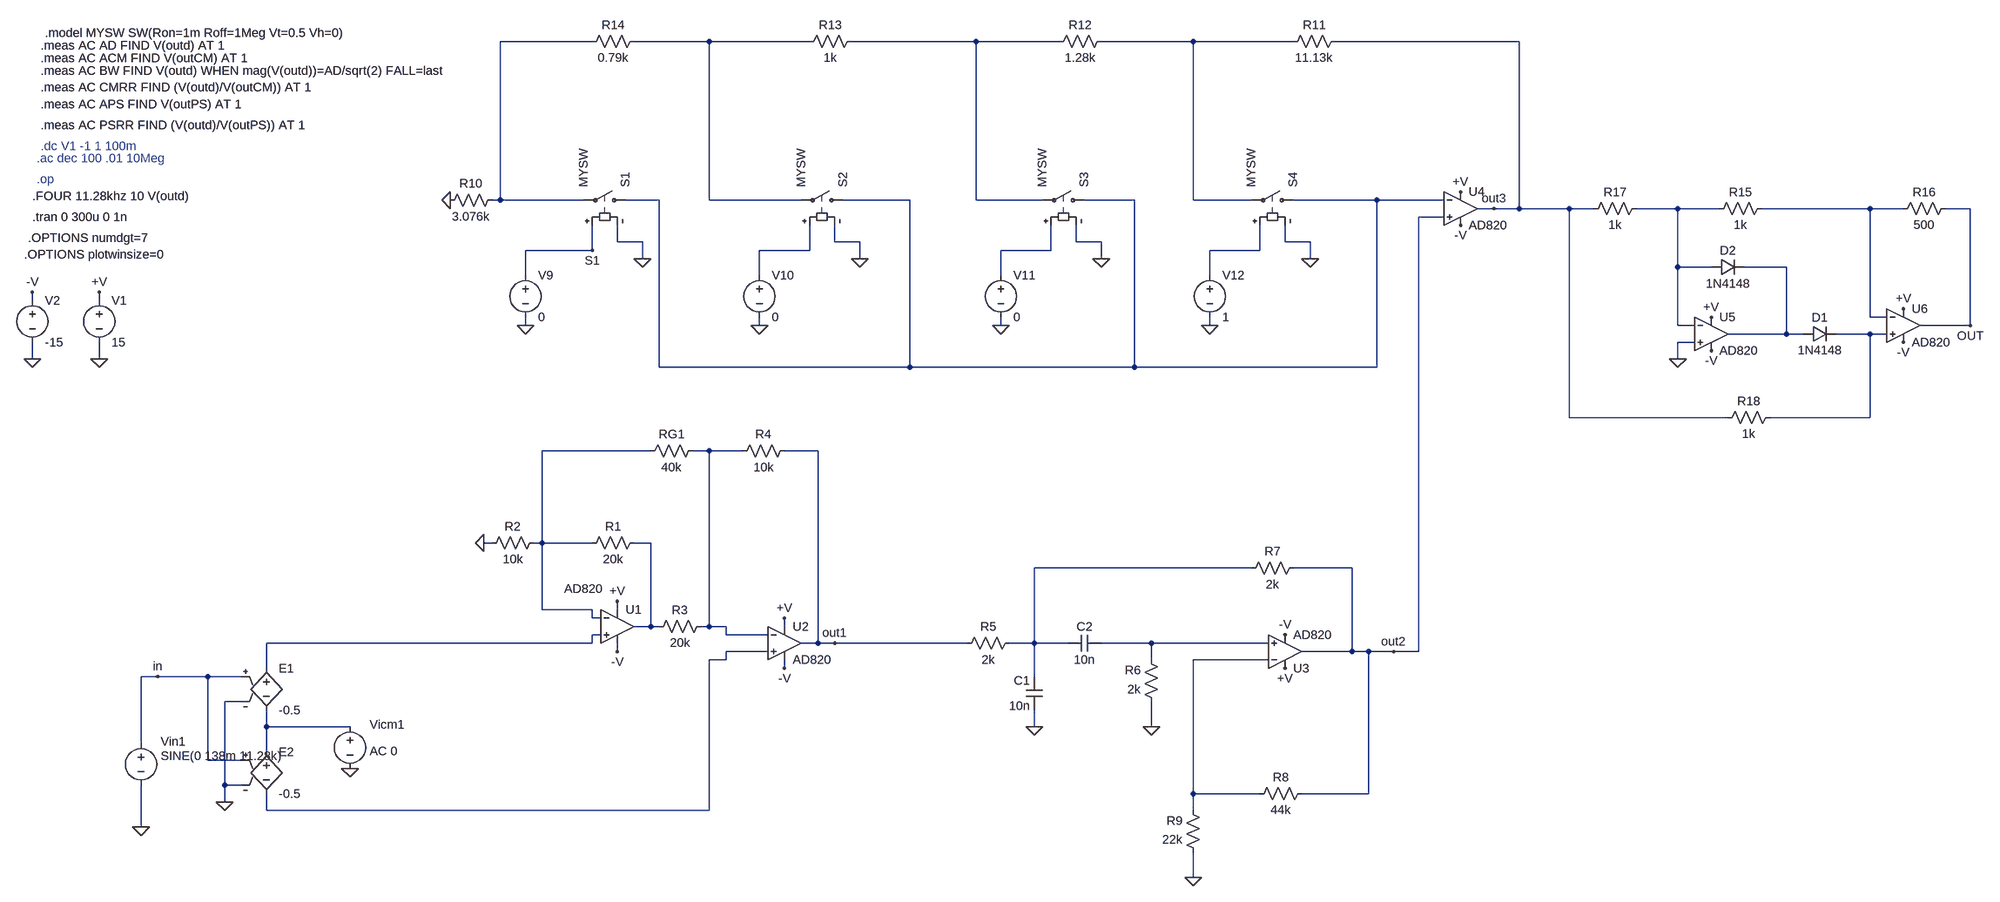
[diagram p0: schematic Circuit_Intreg.asc]
Circuit_Intreg.asc, the LTspice schematic file:
Version 4
SHEET 1 3348 1640
WIRE 368 -832 192 -832
WIRE 592 -832 448 -832
WIRE 784 -832 592 -832
WIRE 1104 -832 864 -832
WIRE 1264 -832 1104 -832
WIRE 1520 -832 1344 -832
WIRE 1712 -832 1520 -832
WIRE 2144 -832 1792 -832
WIRE 192 -528 192 -832
WIRE 192 -528 176 -528
WIRE 352 -528 192 -528
WIRE 496 -528 432 -528
WIRE 592 -528 592 -832
WIRE 768 -528 592 -528
WIRE 976 -528 848 -528
WIRE 1104 -528 1104 -832
WIRE 1232 -528 1104 -528
WIRE 1408 -528 1312 -528
WIRE 1520 -528 1520 -832
WIRE 1632 -528 1520 -528
WIRE 1872 -528 1712 -528
WIRE 2000 -528 1872 -528
WIRE 2096 -512 2064 -512
WIRE 2144 -512 2144 -832
WIRE 2144 -512 2096 -512
WIRE 2240 -512 2144 -512
WIRE 2288 -512 2240 -512
WIRE 2448 -512 2368 -512
WIRE 2528 -512 2448 -512
WIRE 2816 -512 2608 -512
WIRE 2880 -512 2816 -512
WIRE 3008 -512 2960 -512
WIRE 2000 -496 1952 -496
WIRE 416 -448 416 -480
WIRE 464 -448 416 -448
WIRE 832 -448 832 -480
WIRE 880 -448 832 -448
WIRE 1296 -448 1296 -480
WIRE 1344 -448 1296 -448
WIRE 1696 -448 1696 -480
WIRE 1744 -448 1696 -448
WIRE 368 -432 368 -480
WIRE 368 -432 240 -432
WIRE 784 -432 784 -480
WIRE 784 -432 688 -432
WIRE 1248 -432 1248 -480
WIRE 1248 -432 1152 -432
WIRE 1648 -432 1648 -480
WIRE 1648 -432 1552 -432
WIRE 464 -416 464 -448
WIRE 880 -416 880 -448
WIRE 1344 -416 1344 -448
WIRE 1744 -416 1744 -448
WIRE 2448 -400 2448 -512
WIRE 2512 -400 2448 -400
WIRE 2656 -400 2576 -400
WIRE 240 -384 240 -432
WIRE 688 -384 688 -432
WIRE 1152 -384 1152 -432
WIRE 1552 -384 1552 -432
WIRE -704 -336 -704 -352
WIRE -576 -336 -576 -352
WIRE 2816 -304 2816 -512
WIRE 2848 -304 2816 -304
WIRE 240 -288 240 -304
WIRE 688 -288 688 -304
WIRE 1152 -288 1152 -304
WIRE 1552 -288 1552 -304
WIRE 2448 -288 2448 -400
WIRE 2480 -288 2448 -288
WIRE 3008 -288 3008 -512
WIRE 3008 -288 2912 -288
WIRE 2656 -272 2656 -400
WIRE 2656 -272 2544 -272
WIRE 2688 -272 2656 -272
WIRE 2816 -272 2752 -272
WIRE 2848 -272 2816 -272
WIRE 2480 -256 2448 -256
WIRE -704 -224 -704 -256
WIRE -576 -224 -576 -256
WIRE 2448 -224 2448 -256
WIRE 496 -208 496 -528
WIRE 976 -208 976 -528
WIRE 976 -208 496 -208
WIRE 1408 -208 1408 -528
WIRE 1408 -208 976 -208
WIRE 1872 -208 1872 -528
WIRE 1872 -208 1408 -208
WIRE 2240 -112 2240 -512
WIRE 2544 -112 2240 -112
WIRE 2816 -112 2816 -272
WIRE 2816 -112 2624 -112
WIRE 480 -48 272 -48
WIRE 592 -48 560 -48
WIRE 656 -48 592 -48
WIRE 800 -48 736 -48
WIRE 176 128 160 128
WIRE 272 128 272 -48
WIRE 272 128 256 128
WIRE 368 128 272 128
WIRE 480 128 448 128
WIRE 1632 176 1216 176
WIRE 1824 176 1712 176
WIRE 272 256 272 128
WIRE 368 256 272 256
WIRE 416 256 416 240
WIRE 368 272 368 256
WIRE 384 272 368 272
WIRE 480 288 480 128
WIRE 480 288 448 288
WIRE 496 288 480 288
WIRE 592 288 592 -48
WIRE 592 288 576 288
WIRE 624 288 592 288
WIRE 736 288 736 272
WIRE 384 304 368 304
WIRE 624 304 624 288
WIRE 704 304 624 304
WIRE 368 320 368 304
WIRE 368 320 -256 320
WIRE 800 320 800 -48
WIRE 800 320 768 320
WIRE 832 320 800 320
WIRE 1088 320 832 320
WIRE 1216 320 1216 176
WIRE 1216 320 1168 320
WIRE 1280 320 1216 320
WIRE 1440 320 1344 320
WIRE 1664 320 1440 320
WIRE 416 336 416 320
WIRE 704 336 624 336
WIRE 1824 336 1824 176
WIRE 1824 336 1728 336
WIRE 1856 336 1824 336
WIRE 1904 336 1856 336
WIRE 1952 336 1952 -496
WIRE 1952 336 1904 336
WIRE 624 352 624 336
WIRE 624 352 592 352
WIRE 1440 352 1440 320
WIRE 1664 352 1520 352
WIRE -256 368 -256 320
WIRE 736 368 736 352
WIRE -464 384 -496 384
WIRE -368 384 -464 384
WIRE -304 384 -368 384
WIRE 1216 384 1216 320
WIRE -304 432 -336 432
WIRE -256 480 -256 448
WIRE -96 480 -256 480
WIRE 1216 480 1216 448
WIRE 1440 480 1440 432
WIRE -496 512 -496 384
WIRE -256 528 -256 480
WIRE -368 544 -368 384
WIRE -304 544 -368 544
WIRE -336 592 -336 432
WIRE -304 592 -336 592
WIRE 1520 608 1520 352
WIRE 1648 608 1520 608
WIRE 1856 608 1856 336
WIRE 1856 608 1728 608
WIRE -336 624 -336 592
WIRE -256 640 -256 608
WIRE 592 640 592 352
WIRE 592 640 -256 640
WIRE 1520 640 1520 608
WIRE -496 672 -496 592
WIRE 1520 768 1520 720
FLAG -576 -224 0
FLAG 416 240 +V
FLAG -576 -352 +V
FLAG 416 336 -V
FLAG -704 -224 0
FLAG -704 -352 -V
FLAG 160 128 0
FLAG 736 272 +V
FLAG 736 368 -V
FLAG 832 320 out1
FLAG -496 672 0
FLAG -336 624 0
FLAG -96 560 0
FLAG 1440 480 0
FLAG 1216 480 0
FLAG 1520 768 0
FLAG 96 -528 0
FLAG 2032 -544 +V
FLAG 2032 -480 -V
FLAG 2096 -512 out3
FLAG 368 -432 S1
FLAG 464 -416 0
FLAG 880 -416 0
FLAG 1344 -416 0
FLAG 1744 -416 0
FLAG 1552 -288 0
FLAG 1152 -288 0
FLAG 240 -288 0
FLAG 688 -288 0
FLAG 2448 -224 0
FLAG 2880 -320 +V
FLAG 2880 -256 -V
FLAG 1696 368 +V
FLAG 1696 304 -V
FLAG 2512 -304 +V
FLAG 2512 -240 -V
FLAG 3008 -288 OUT
FLAG -464 384 in
FLAG 1904 336 out2
SYMBOL voltage -576 -352 R0
WINDOW 123 0 0 Left 2
WINDOW 39 0 0 Left 2
SYMATTR InstName V1
SYMATTR Value 15
SYMBOL voltage -704 -352 R0
WINDOW 123 0 0 Left 2
WINDOW 39 0 0 Left 2
SYMATTR InstName V2
SYMATTR Value -15
SYMBOL res 464 112 R90
WINDOW 0 0 56 VBottom 2
WINDOW 3 32 56 VTop 2
SYMATTR InstName R1
SYMATTR Value 20k
SYMBOL res 272 112 R90
WINDOW 0 0 56 VBottom 2
WINDOW 3 32 56 VTop 2
SYMATTR InstName R2
SYMATTR Value 10k
SYMBOL res 576 -64 R90
WINDOW 0 0 56 VBottom 2
WINDOW 3 32 56 VTop 2
SYMATTR InstName RG1
SYMATTR Value 40k
SYMBOL res 592 272 R90
WINDOW 0 0 56 VBottom 2
WINDOW 3 32 56 VTop 2
SYMATTR InstName R3
SYMATTR Value 20k
SYMBOL res 752 -64 R90
WINDOW 0 0 56 VBottom 2
WINDOW 3 32 56 VTop 2
SYMATTR InstName R4
SYMATTR Value 10k
SYMBOL voltage -496 496 R0
WINDOW 123 38 68 Left 2
WINDOW 39 0 0 Left 2
WINDOW 0 38 12 Left 2
WINDOW 3 38 40 Left 2
SYMATTR InstName Vin1
SYMATTR Value SINE(0 138m 11.28k)
SYMBOL e -256 352 R0
SYMATTR InstName E1
SYMATTR Value -0.5
SYMBOL e -256 512 R0
SYMATTR InstName E2
SYMATTR Value -0.5
SYMBOL voltage -96 464 R0
WINDOW 123 38 63 Left 2
WINDOW 39 0 0 Left 2
WINDOW 0 38 12 Left 2
WINDOW 3 -188 38 Left 2
SYMATTR Value2 AC 0
SYMATTR InstName Vicm1
SYMATTR Value ""
SYMBOL OpAmps\\AD820 416 224 R0
WINDOW 3 -102 -8 Left 2
SYMATTR InstName U1
SYMBOL OpAmps\\AD820 736 256 R0
SYMATTR InstName U2
SYMBOL cap 1232 384 M0
SYMATTR InstName C1
SYMATTR Value 10n
SYMBOL res 1184 304 R90
WINDOW 0 0 56 VBottom 2
WINDOW 3 32 56 VTop 2
SYMATTR InstName R5
SYMATTR Value 2k
SYMBOL res 1456 448 R180
WINDOW 0 36 76 Left 2
WINDOW 3 36 40 Left 2
SYMATTR InstName R6
SYMATTR Value 2k
SYMBOL cap 1280 336 R270
WINDOW 0 32 32 VTop 2
WINDOW 3 0 32 VBottom 2
SYMATTR InstName C2
SYMATTR Value 10n
SYMBOL res 1728 160 R90
WINDOW 0 0 56 VBottom 2
WINDOW 3 32 56 VTop 2
SYMATTR InstName R7
SYMATTR Value 2k
SYMBOL res 1744 592 R90
WINDOW 0 0 56 VBottom 2
WINDOW 3 32 56 VTop 2
SYMATTR InstName R8
SYMATTR Value 44k
SYMBOL res 1536 736 R180
WINDOW 0 36 76 Left 2
WINDOW 3 36 40 Left 2
SYMATTR InstName R9
SYMATTR Value 22k
SYMBOL OpAmps\\AD820 1696 400 M180
SYMATTR InstName U3
SYMBOL OpAmps\\AD820 2032 -576 R0
SYMATTR InstName U4
SYMBOL res 192 -544 R90
WINDOW 0 0 56 VBottom 2
WINDOW 3 32 56 VTop 2
SYMATTR InstName R10
SYMATTR Value 3.076k
SYMBOL res 1808 -848 R90
WINDOW 0 0 56 VBottom 2
WINDOW 3 32 56 VTop 2
SYMATTR InstName R11
SYMATTR Value 11.13k
SYMBOL res 1360 -848 R90
WINDOW 0 0 56 VBottom 2
WINDOW 3 32 56 VTop 2
SYMATTR InstName R12
SYMATTR Value 1.28k
SYMBOL res 880 -848 R90
WINDOW 0 0 56 VBottom 2
WINDOW 3 32 56 VTop 2
SYMATTR InstName R13
SYMATTR Value 1k
SYMBOL res 464 -848 R90
WINDOW 0 0 56 VBottom 2
WINDOW 3 32 56 VTop 2
SYMATTR InstName R14
SYMATTR Value 0.79k
SYMBOL sw 448 -528 M270
SYMATTR InstName S1
SYMATTR Value MYSW
SYMBOL sw 864 -528 M270
SYMATTR InstName S2
SYMATTR Value MYSW
SYMBOL sw 1328 -528 M270
SYMATTR InstName S3
SYMATTR Value MYSW
SYMBOL sw 1728 -528 M270
SYMATTR InstName S4
SYMATTR Value MYSW
SYMBOL voltage 240 -400 R0
WINDOW 123 0 0 Left 0
WINDOW 39 0 0 Left 0
SYMATTR InstName V9
SYMATTR Value 0
SYMBOL voltage 688 -400 R0
WINDOW 123 0 0 Left 0
WINDOW 39 0 0 Left 0
SYMATTR InstName V10
SYMATTR Value 0
SYMBOL voltage 1152 -400 R0
WINDOW 123 0 0 Left 0
WINDOW 39 0 0 Left 0
SYMATTR InstName V11
SYMATTR Value 0
SYMBOL voltage 1552 -400 R0
WINDOW 123 0 0 Left 0
WINDOW 39 0 0 Left 0
SYMATTR InstName V12
SYMATTR Value 1
SYMBOL OpAmps\\AD820 2512 -336 R0
SYMATTR InstName U5
SYMBOL OpAmps\\AD820 2880 -352 R0
SYMATTR InstName U6
SYMBOL diode 2688 -256 R270
WINDOW 0 32 32 VTop 2
WINDOW 3 0 32 VBottom 2
SYMATTR InstName D1
SYMATTR Value 1N4148
SYMBOL diode 2512 -384 R270
WINDOW 0 32 32 VTop 2
WINDOW 3 0 32 VBottom 2
SYMATTR InstName D2
SYMATTR Value 1N4148
SYMBOL res 2624 -528 R90
WINDOW 0 0 56 VBottom 2
WINDOW 3 32 56 VTop 2
SYMATTR InstName R15
SYMATTR Value 1k
SYMBOL res 2976 -528 R90
WINDOW 0 0 56 VBottom 2
WINDOW 3 32 56 VTop 2
SYMATTR InstName R16
SYMATTR Value 500
SYMBOL res 2384 -528 R90
WINDOW 0 0 56 VBottom 2
WINDOW 3 32 56 VTop 2
SYMATTR InstName R17
SYMATTR Value 1k
SYMBOL res 2640 -128 R90
WINDOW 0 0 56 VBottom 2
WINDOW 3 32 56 VTop 2
SYMATTR InstName R18
SYMATTR Value 1k
TEXT -696 -608 Left 2 ;.ac dec 100 .01 10Meg
TEXT -688 -824 Left 2 !.meas AC AD FIND V(outd) AT 1
TEXT -688 -800 Left 2 !.meas AC ACM FIND V(outCM) AT 1
TEXT -688 -776 Left 2 !.meas AC BW FIND V(outd) WHEN mag(V(outd))=AD/sqrt(2) FALL=last
TEXT -688 -744 Left 2 !.meas AC CMRR FIND (V(outd)/V(outCM)) AT 1
TEXT -688 -672 Left 2 !.meas AC PSRR FIND (V(outd)/V(outPS)) AT 1
TEXT -688 -712 Left 2 !.meas AC APS FIND V(outPS) AT 1
TEXT -696 -568 Left 2 ;.op
TEXT -704 -536 Left 2 !.FOUR 11.28khz 10 V(outd)
TEXT -704 -496 Left 2 !.tran 0 300u 0 1n
TEXT -712 -456 Left 2 !.OPTIONS numdgt=7
TEXT -720 -424 Left 2 !.OPTIONS plotwinsize=0
TEXT -680 -848 Left 2 !.model MYSW SW(Ron=1m Roff=1Meg Vt=0.5 Vh=0)
TEXT -688 -632 Left 2 ;.dc V1 -1 1 100m

The netlist it stands for:
* Circuit_Intreg.asc
V1 +V 0 15
V2 -V 0 -15
R1 N015 N013 20k
R2 N013 0 10k
RG1 N014 N013 40k
R3 N014 N015 20k
R4 out1 N014 10k
Vin1 in 0 SINE(0 138m 11.28k)
E1 N017 N021 in 0 -0.5
E2 N021 N019 in 0 -0.5
Vicm1 N021 0 AC 0
XU1 N017 N013 +V -V N015 AD820  ; pins In+ In- V+ V- OUT
XU2 N019 N014 +V -V out1 AD820  ; pins In+ In- V+ V- OUT
C1 N016 0 10n
R5 N016 out1 2k
R6 0 N018 2k
C2 N016 N018 10n
R7 out2 N016 2k
R8 out2 N020 44k
R9 0 N020 22k
XU3 N018 N020 +V -V out2 AD820  ; pins In+ In- V+ V- OUT
XU4 out2 N005 +V -V out3 AD820  ; pins In+ In- V+ V- OUT
R10 N001 0 3.076k
R11 out3 N004 11.13k
R12 N004 N003 1.28k
R13 N003 N002 1k
R14 N002 N001 0.79k
S1 N005 N001 S1 0 MYSW
S2 N005 N002 N008 0 MYSW
S3 N005 N003 N009 0 MYSW
S4 N005 N004 N010 0 MYSW
V9 S1 0 0
V10 N008 0 0
V11 N009 0 0
V12 N010 0 1
XU5 0 N006 +V -V N011 AD820  ; pins In+ In- V+ V- OUT
XU6 N012 N007 +V -V OUT AD820  ; pins In+ In- V+ V- OUT
D1 N011 N012 1N4148
D2 N006 N011 1N4148
R15 N007 N006 1k
R16 OUT N007 500
R17 N006 out3 1k
R18 N012 out3 1k
.model D D
.lib standard.dio
* .ac dec 100 .01 10Meg
.meas AC AD FIND V(outd) AT 1
.meas AC ACM FIND V(outCM) AT 1
.meas AC BW FIND V(outd) WHEN mag(V(outd))=AD/sqrt(2) FALL=last
.meas AC CMRR FIND (V(outd)/V(outCM)) AT 1
.meas AC PSRR FIND (V(outd)/V(outPS)) AT 1
.meas AC APS FIND V(outPS) AT 1
* .op
.FOUR 11.28khz 10 V(outd)
.tran 0 300u 0 1n
.OPTIONS numdgt=7
.OPTIONS plotwinsize=0
.model MYSW SW(Ron=1m Roff=1Meg Vt=0.5 Vh=0)
* .dc V1 -1 1 100m
.backanno
.end